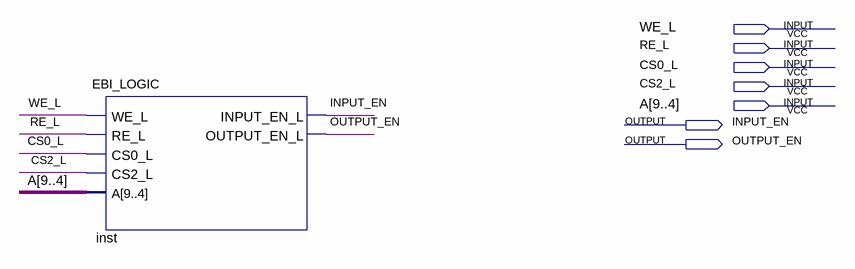
[diagram p0: schematic sheet]
// Quartus schematic Lab4_EBI.bdf as structural Verilog: 1 symbols, 7 pins
module Lab4_EBI (
  input  WE_L,
  input  RE_L,
  input  CS0_L,
  input  CS2_L,
  input  [9:4] A,
  output INPUT_EN,
  output OUTPUT_EN
);

  EBI_LOGIC inst (
    .WE_L(WE_L), .RE_L(RE_L), .CS0_L(CS0_L), .CS2_L(CS2_L), .A(A), .INPUT_EN_L(INPUT_EN),
    .OUTPUT_EN_L(OUTPUT_EN));
endmodule
